# EAGLE design pic16f1508_breakout (EAGLE 8.7.0)
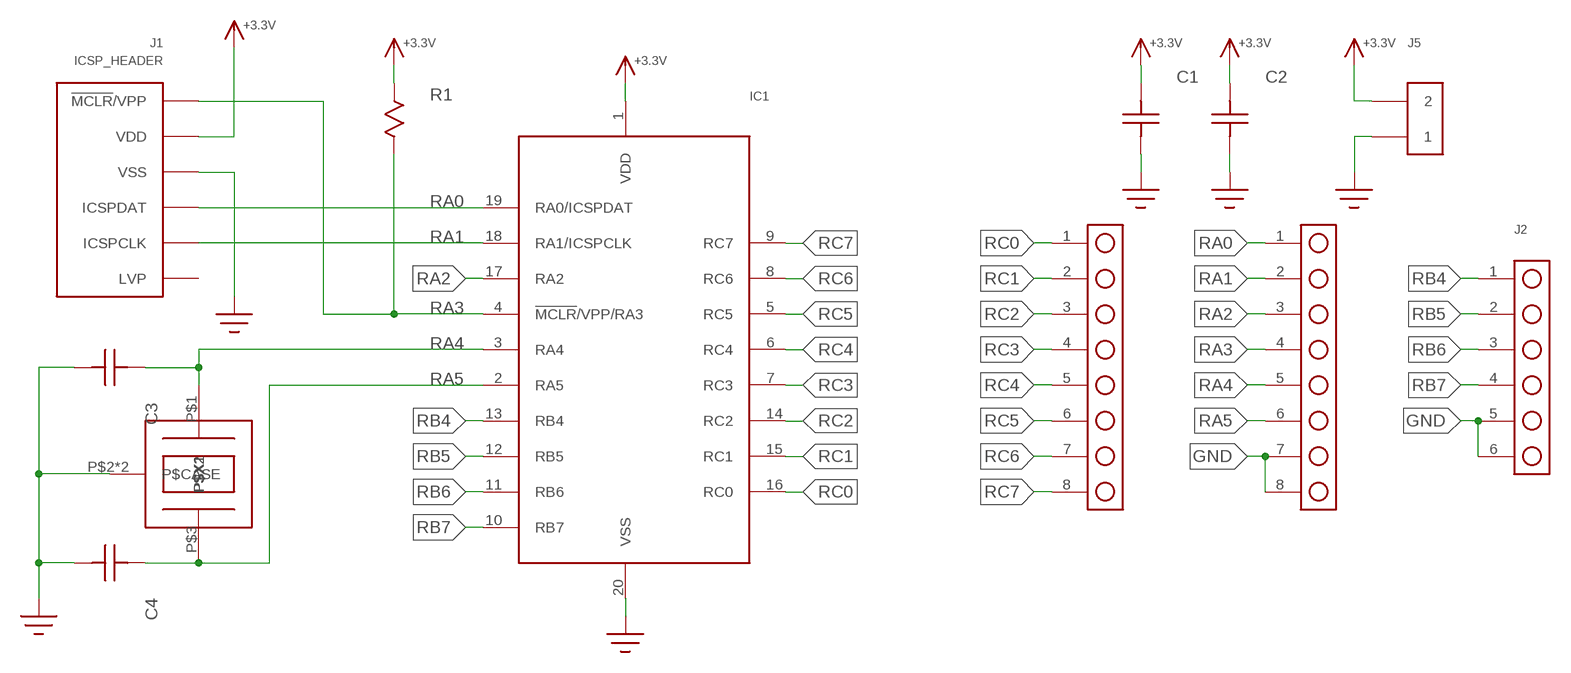
[diagram p0: schematic, sheet 1]

## Parts
C1  C1206  [1206]
C2  C0805  [0805]
C3  C0603  [C0603]
C4  C0603  [C0603]
IC1  PIC16F1508  [20SOIC_75]
J1  ICSP_HEADER  [HEADER_6P]
J2  HEADER_6_PIN  [HEADER_6P]
J3  HEADER_8_PIN  [HEADER_8_PIN]
J4  HEADER_8_PIN  [HEADER_8_PIN]
J5  HEADER_2_PIN  [HEADER_2_PIN]
R1  R0805  [R0805]
U$10  XTAL  [CRYSTAL_3.2X2.5]

## Nets
+3.3V: C1.P$2 C2.P$2 IC1.1(VDD) J1.2(VDD) J5.2 R1.P$1
GND: C1.P$1 C2.P$1 C3.P$1 C4.P$1 IC1.20(VSS) J1.3(VSS) J2.5 J2.6 J4.7 J4.8 J5.1 U$10.P$2(P$CASE) U$10.P$4(P$CASE)
RA0: IC1.19(RA0/ICSPDAT) J1.4(ICSPDAT) J4.1
RA1: IC1.18(RA1/ICSPCLK) J1.5(ICSPCLK) J4.2
RA2: IC1.17(RA2) J4.3
RA3: IC1.4(!MCLR!/VPP/RA3) J1.1(!MCLR!/VPP) J4.4 R1.P$2
RA4: C3.P$2 IC1.3(RA4) J4.5 U$10.P$1(P$X1)
RA5: C4.P$2 IC1.2(RA5) J4.6 U$10.P$3(P$X2)
RB4: IC1.13(RB4) J2.1
RB5: IC1.12(RB5) J2.2
RB6: IC1.11(RB6) J2.3
RB7: IC1.10(RB7) J2.4
RC0: IC1.16(RC0) J3.1
RC1: IC1.15(RC1) J3.2
RC2: IC1.14(RC2) J3.3
RC3: IC1.7(RC3) J3.4
RC4: IC1.6(RC4) J3.5
RC5: IC1.5(RC5) J3.6
RC6: IC1.8(RC6) J3.7
RC7: IC1.9(RC7) J3.8
Unconnected: J1.6(LVP)

## Library data of the parts
C1-C4 = ssir:C
IC1 = ssir:PIC16F1508
J1 = ssir:ICSP_HEADER
J2 = ssir:HEADER_6_PIN
J3 J4 = ssir:HEADER_8_PIN
J5 = ssir:HEADER_2_PIN
R1 = ssir:R
U$10 = ssir:XTAL

## Board
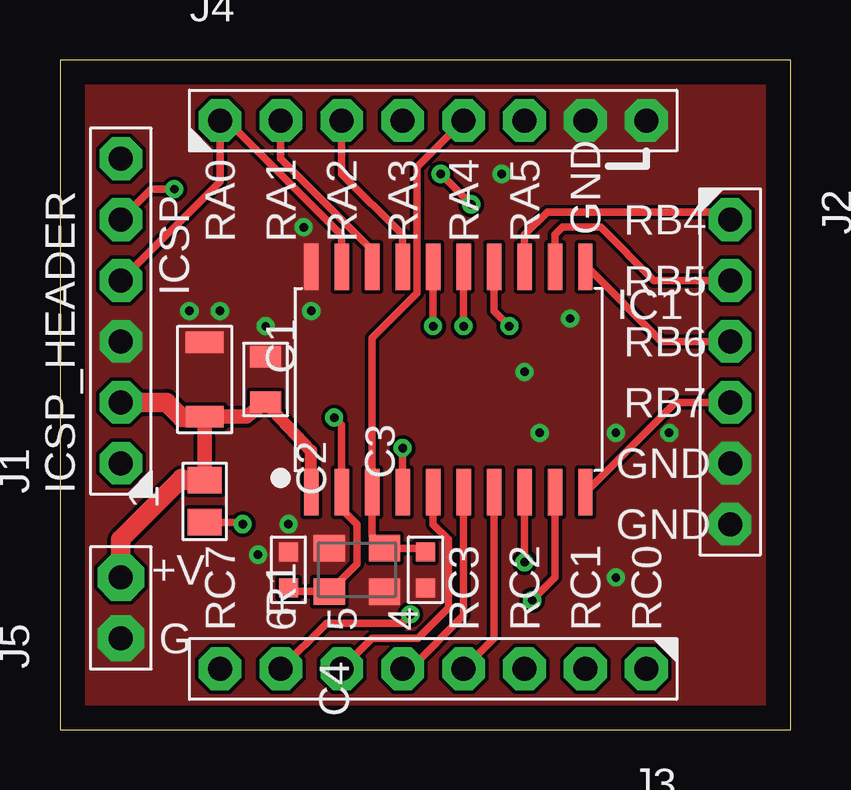
[diagram p1: board, top side]
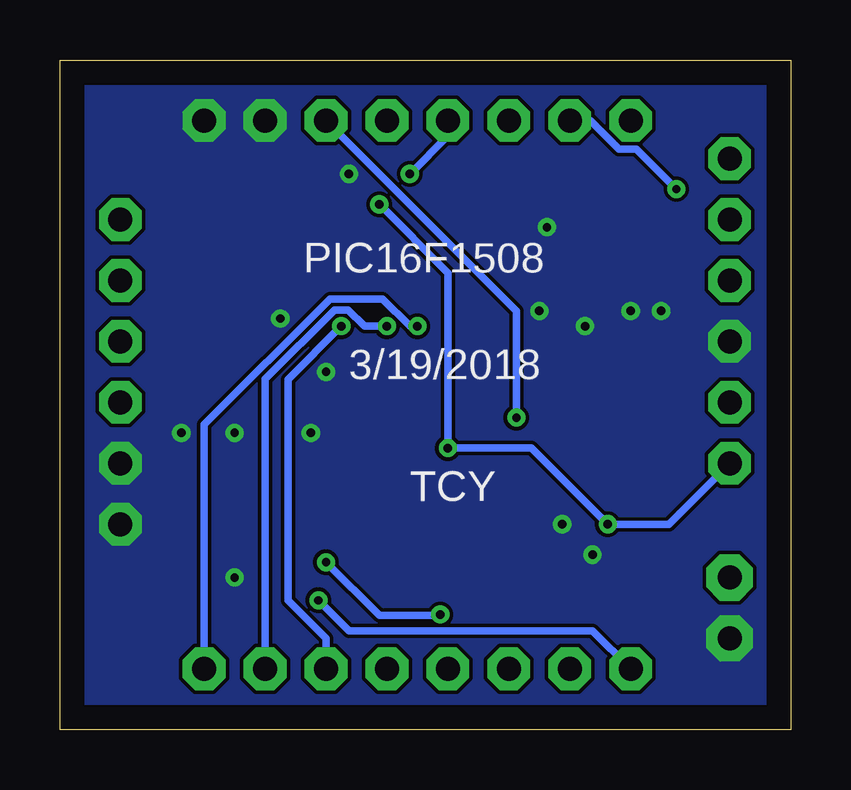
[diagram p2: board, bottom side, seen from below]

Size 30.46 x 27.93 mm. Coordinates in mm from the lower left corner, seen from the top.
Outline: 0,0 30.46,0 30.46,27.93 0,27.93 0,0
Copper layers (1*16): Top 0.035mm / dielectric 1.5mm / Bottom 0.035mm
Design rules "default": minimum track width 6mil, minimum drill 0.35mm, track to track 6mil, track to pad 6mil, pad to pad 6mil, via to via 6mil, smd to smd 6mil, copper to edge 40mil, drill to drill 6mil, minimum pad ring 10mil, minimum via ring 8mil, stop-mask expansion 4mil, vias tented up to drill 0mil, thermal gap 10mil

### Footprints (pad centres in the part's own frame; a part is rotated, then mirrored left to right if it is on the bottom)
1206 = smd 0.9 x 1.6: P$1 -1.55,0; P$2 1.55,0
0805 = smd 0.9 x 1.3: P$1 -0.95,0; P$2 0.95,0
C0603 = smd 0.8 x 0.8: P$1 -0.75,0; P$2 0.75,0
20SOIC_75 = smd 0.6 x 1.95: 1 -5.715,-4.7; 2 -4.445,-4.7; 3 -3.175,-4.7; 4 -1.905,-4.7; 5 -0.635,-4.7; 6 0.635,-4.7; 7 1.905,-4.7; 8 3.175,-4.7; 9 4.445,-4.7; 10 5.715,-4.7; 11 5.715,4.7; 12 4.445,4.7; 13 3.175,4.7; 14 1.905,4.7; 15 0.635,4.7; 16 -0.635,4.7; 17 -1.905,4.7; 18 -3.175,4.7; 19 -4.445,4.7; 20 -5.715,4.7
HEADER_6P = drill 1 pad 1.778 octagon: 1 -6.35,0; 2 -3.81,0; 3 -1.27,0; 4 1.27,0; 5 3.81,0; 6 6.35,0
HEADER_8_PIN = drill 1 pad 1.778 octagon: 1 -8.89,0; 2 -6.35,0; 3 -3.81,0; 4 -1.27,0; 5 1.27,0; 6 3.81,0; 7 6.35,0; 8 8.89,0
HEADER_2_PIN = drill 1 pad 1.93 octagon: 1 -1.27,0; 2 1.27,0
R0805 = smd 1.1 x 1.4: P$1 -0.875,0; P$2 0.875,0
CRYSTAL_3.2X2.5 = smd 1.3 x 1.1: P$1 -1.15,-0.9; P$2 1.15,-0.9; P$3 1.15,0.9; P$4 -1.15,0.9

### Placement (x,y rotation side)
C1  6.03,14.61 270 top
C2  8.57,14.61 270 top
C3  15.24,6.67 90 top
C4  9.53,6.67 270 top
IC1  16.19,14.61 0 top
J1  2.54,17.46 90 top
J2  27.94,14.92 270 top
J3  15.56,2.54 180 top
J4  15.56,25.4 0 top
J5  2.54,5.08 90 top
R1  6.03,9.53 270 top
U$10  12.38,6.67 180 top

### Tracks (layer width: path | path; a pad name or v marks a point on that pad's centre or on a via)
+3.3V
  Top 0.508: IC1.1 10.48,11.63 C2.P$2
  Top 0.61: C2.P$2 7.77,13.05 C1.P$2 R1.P$1
  Top 0.813: J5.2 2.54,7.94 5.08,10.48 5.16,10.4 R1.P$1 | J1.2 4.45,13.65 5.08,13.02 6.31,13.02 C1.P$2
GND  (via drill 0.35)
  other vias: 5.4,17.46 6.67,17.46 8.57,16.83 10.48,17.46 10.16,20.95 18.41,23.18 21.27,17.14 19.37,14.92 20,12.38 23.18,12.38 25.4,12.38 23.18,6.35 9.53,8.57 8.26,7.3
  pour Top (no thermals): 0,0 30.48,0 30.48,27.94 0,27.94
  pour Bottom (no thermals): 0,0 30.48,0 30.48,27.94 0,27.94
RA0
  Top 0.305: IC1.19 11.75,20.63 6.97,25.4 J4.1 6.67,22.86 J1.4
RA1  (via drill 0.35)
  Top 0.305: IC1.18 13.02,20 9.21,23.81 J4.2 | J1.5 3.81,22.54 v4.76,22.54
  Bottom 0.305: v4.76,22.54 6.43,24.21 7.16,24.21 8.36,25.4 J4.2
RA2
  Top 0.305: IC1.17 14.29,20.64 11.75,23.18 J4.3
RA3  (via drill 0.35)
  Top 0.305: v7.62,8.57 7.54,8.65 R1.P$2 | v14.29,11.75 IC1.4 | v17.14,21.91 v15.88,23.18
  Bottom 0.305: J1.1 5.08,8.57 v7.62,8.57 10.79,11.75 v14.29,11.75 14.29,19.05 v17.14,21.91 | v15.88,23.18 14.29,24.77 J4.4
RA4
  Top 0.305: C3.P$2 15.09,7.57 U$10.P$1 13.02,8.08 IC1.3 13.02,16.33 14.89,18.2 14.89,23.46 J4.5
RA5  (via drill 0.35)
  Top 0.305: C4.P$2 9.68,5.77 U$10.P$3 12.38,6.92 12.38,8.57 11.75,9.21 IC1.2 11.75,12.7 v11.43,13.02
  Bottom 0.305: v11.43,13.02 11.43,17.46 J4.6
RB4
  Top 0.305: IC1.13 19.37,20.64 20.32,21.59 27.62,21.59 J2.1
RB5
  Top 0.305: IC1.12 20.64,20.64 20.95,20.95 22.54,20.95 24.77,18.73 J2.2
RB6
  Top 0.305: IC1.11 21.97,19.3 25.08,16.19 J2.3
RB7
  Top 0.305: IC1.10 25.66,13.65 J2.4
RC0  (via drill 0.35)
  Top 0.305: IC1.16 v15.56,16.83
  Bottom 0.305: v15.56,16.83 15.86,16.83 17,17.97 19.2,17.97 24.45,12.72 J3.1
RC1  (via drill 0.35)
  Top 0.305: IC1.15 v16.83,16.83
  Bottom 0.305: v16.83,16.83 17.77,16.83 18.45,17.51 19.02,17.51 21.91,14.62 J3.2
RC2  (via drill 0.35)
  Top 0.305: IC1.14 18.1,17.46 v18.73,16.83
  Bottom 0.305: v18.73,16.83 20.95,14.61 20.95,5.4 19.37,3.81 J3.3
RC3
  Top 0.305: IC1.7 18.1,3.81 J3.4
RC4
  Top 0.305: IC1.6 16.83,4.76 14.61,2.54 J3.5
RC5
  Top 0.305: IC1.5 15.56,8.57 16.19,7.94 16.19,5.08 14.92,3.81 13.02,3.81 J3.6
RC6  (via drill 0.35)
  Top 0.305: IC1.8 v19.37,6.99 | v14.61,4.81 14.24,4.45 11.11,4.45 J3.7
  Bottom 0.305: v19.37,6.99 17.14,4.76 14.61,4.76 v14.61,4.81
RC7  (via drill 0.35)
  Top 0.305: IC1.9 20.64,6.35 v19.68,5.4
  Bottom 0.305: v19.68,5.4 18.41,4.13 8.26,4.13 J3.8

### Text on the board
tPlace: RA0 | RA1 | RA2 | RA3 | RA4 | RA5 | GND | RB4 | ICSP | RB5 | RB6 | RB7 | GND | 1 | GND | +V | RC7 | 6 | 5 | 4 | RC3 | RC2 | RC1 | RC0 | G
bPlace: PIC16F1508 | 3/19/2018 | TCY